# EAGLE design driver (EAGLE 6.4)
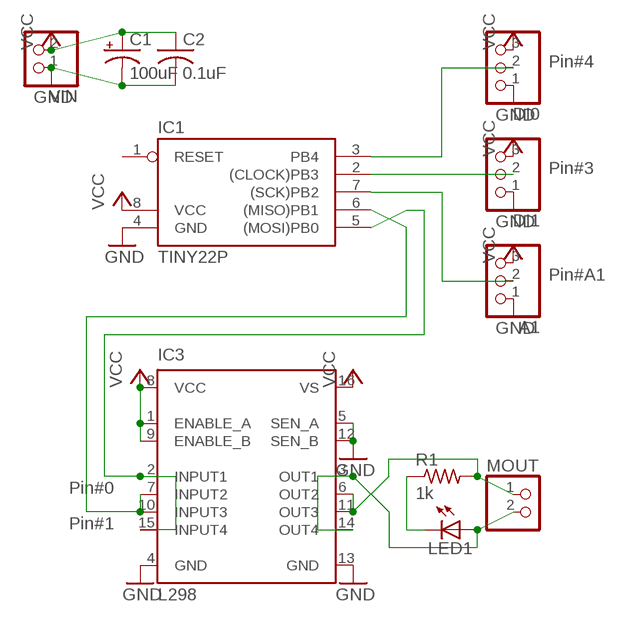
[diagram p0: schematic, sheet 1]

## Parts
A1  PINHD-1X3  [1X03]
C1  100uF  CPOL-USE2,5-6E  [E2,5-6E]
C2  0.1uF  C-US025-025X050  [C025-025X050]
DI0  PINHD-1X3  [1X03]
DI1  PINHD-1X3  [1X03]
IC1  TINY22P  [DIL08]
IC3  L298  [DIL16]
LED1  LED5MM  [LED5MM]
MOUT  PINHD-1X2  [1X02]
R1  1k  R-US_0204/2V  [0204V]
VIN  PINHD-1X2  [1X02]

## Nets
GND: A1.1 C1.- C2.2 DI0.1 DI1.1 IC1.4(GND) IC3.4(GND) IC3.5(SEN_A) IC3.12(SEN_B) IC3.13(GND) VIN.1
N$1: IC1.5((MOSI)PB0) IC3.2(INPUT1) IC3.15(INPUT4)
N$2: IC1.6((MISO)PB1) IC3.7(INPUT2) IC3.10(INPUT3)
N$3: IC3.6(OUT2) IC3.11(OUT3) MOUT.1 R1.2
N$4: IC3.3(OUT1) IC3.14(OUT4) LED1.A MOUT.2
N$7: LED1.K(C) R1.1
N$8: DI1.2 IC1.2((CLOCK)PB3)
N$9: DI0.2 IC1.3(PB4)
N$10: A1.2 IC1.7((SCK)PB2)
VCC: A1.3 C1.+ C2.1 DI0.3 DI1.3 IC1.8(VCC) IC3.1(ENABLE_A) IC3.8(VCC) IC3.9(ENABLE_B) IC3.16(VS) VIN.2
Unconnected: IC1.1(RESET)

## Notes on the sheet
- Pin#4
- Pin#3
- Pin#A1
- Pin#0
- Pin#1

## Library data of the parts
A1 DI0 DI1 = pinhead:PINHD-1X3: PIN HEADER
C1 = resistor:CPOL-US: POLARIZED CAPACITOR, American symbol
C2 = resistor:C-US: CAPACITOR, American symbol
IC1 = atmel:TINY22: MICROCONTROLLER 1K ROM 128 bytes RAM 128 bytes EEPROM; OC_FARNELL: unknown; OC_NEWARK: unknown
IC3 = st-microelectronics:L298: DUAL FULL-BRIDGE DRIVER
LED1 = led:LED: LED OSRAM: - CHIPLED LG R971, LG N971, LY N971, LG Q971, LY Q971, LO R971, LY R971 LH N974, LH R974 LS Q976, LO Q976, LY Q976 LO Q996 - Hyper CHIPLED LW Q18S LB Q993, LB Q99A, LB R99A - SideLED LS A670, LO A670, LY A670, LG A670, LP A670 LB A673, LV A673, LT A673, LW A673 LH A674 LY A675 LS A676, LA A676, LO A676, LY A676, LW A676 LS A679, LY A679, LG A679 - Hyper Micro SIDELED® LS Y876, LA Y876, LO Y876, LY Y876 LT Y87S - SmartLED LW L88C, LW L88S LB L89C, LB L89S, LG L890 LS L89K, LO L89K, LY L89K LS L896, LA L896, LO L896, LY L896 - TOPLED LS T670, LO T670, LY T670, LG T670, LP T670 LSG T670, LSP T670, LSY T670, LOP T670, LYG T670 LG T671, LOG T671, LSG T671 LB T673, LV T673, LT T673, LW T673 LH T674 LS T676, LA T676, LO T676, LY T676, LB T676, LH T676, LSB T676, LW T676 LB T67C, LV T67C, LT T67C, LS T67K, LO T67K, LY T67K, LW E67C LS E67B, LA E67B, LO E67B, LY E67B, LB E67C, LV E67C, LT E67C LW T67C LS T679, LY T679, LG T679 LS T770, LO T770, LY T770, LG T770, LP T770 LB T773, LV T773, LT T773, LW T773 LH T774 LS E675, LA E675, LY E675, LS T675 LS T776, LA T776, LO T776, LY T776, LB T776 LHGB T686 LT T68C, LB T68C - Hyper Mini TOPLED® LB M676 - Mini TOPLED Santana® LG M470 LS M47K, LO M47K, LY M47K Source: http://www.osram.convergy.de LUXEON: - LUMILED® LXK2-PW12-R00, LXK2-PW12-S00, LXK2-PW14-U00, LXK2-PW14-V00 LXK2-PM12-R00, LXK2-PM12-S00, LXK2-PM14-U00 LXK2-PE12-Q00, LXK2-PE12-R00, LXK2-PE12-S00, LXK2-PE14-T00, LXK2-PE14-U00 LXK2-PB12-K00, LXK2-PB12-L00, LXK2-PB12-M00, LXK2-PB14-N00, LXK2-PB14-P00, LXK2-PB14-Q00 LXK2-PR12-L00, LXK2-PR12-M00, LXK2-PR14-Q00, LXK2-PR14-R00 LXK2-PD12-Q00, LXK2-PD12-R00, LXK2-PD12-S00 LXK2-PH12-R00, LXK2-PH12-S00 LXK2-PL12-P00, LXK2-PL12-Q00, LXK2-PL12-R00 Source: www.luxeon.com KINGBRIGHT: KA-3528ASYC Source: www.kingbright.com
MOUT VIN = pinhead:PINHD-1X2: PIN HEADER
R1 = resistor:R-US_: RESISTOR, American symbol

## Board
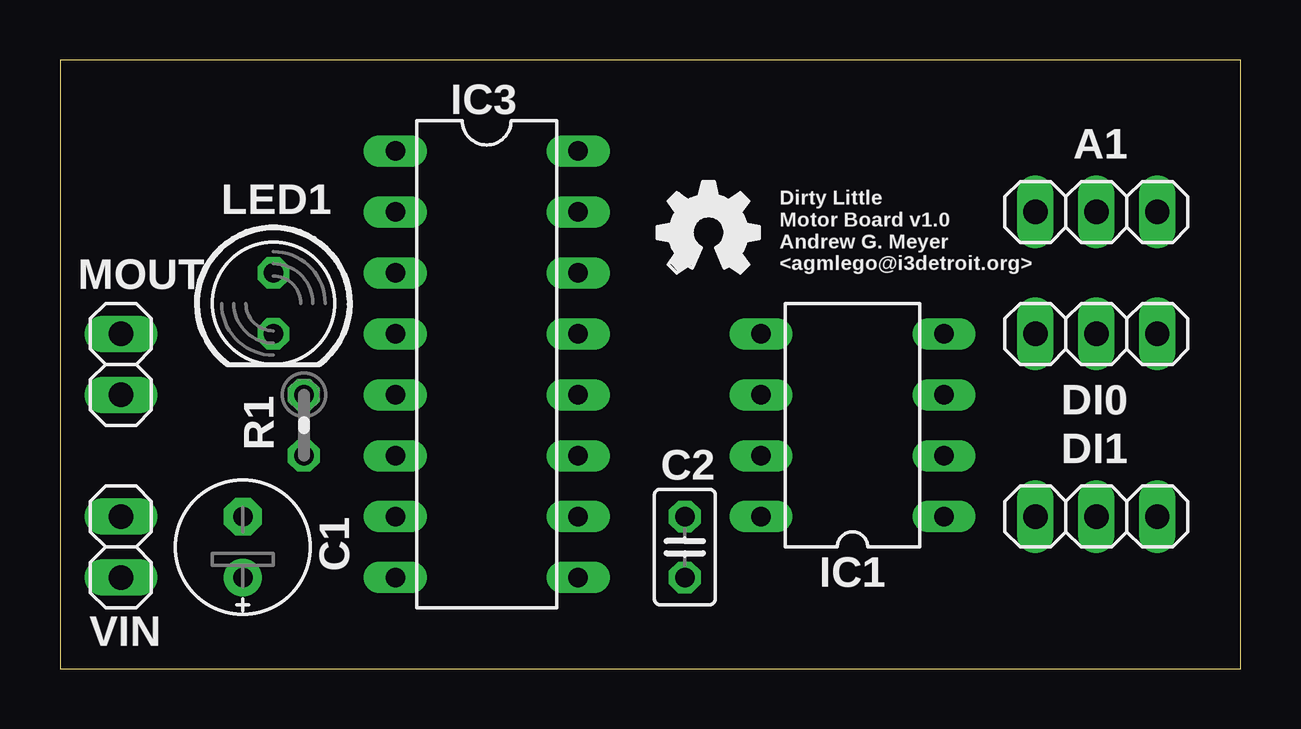
[diagram p1: board, top side]
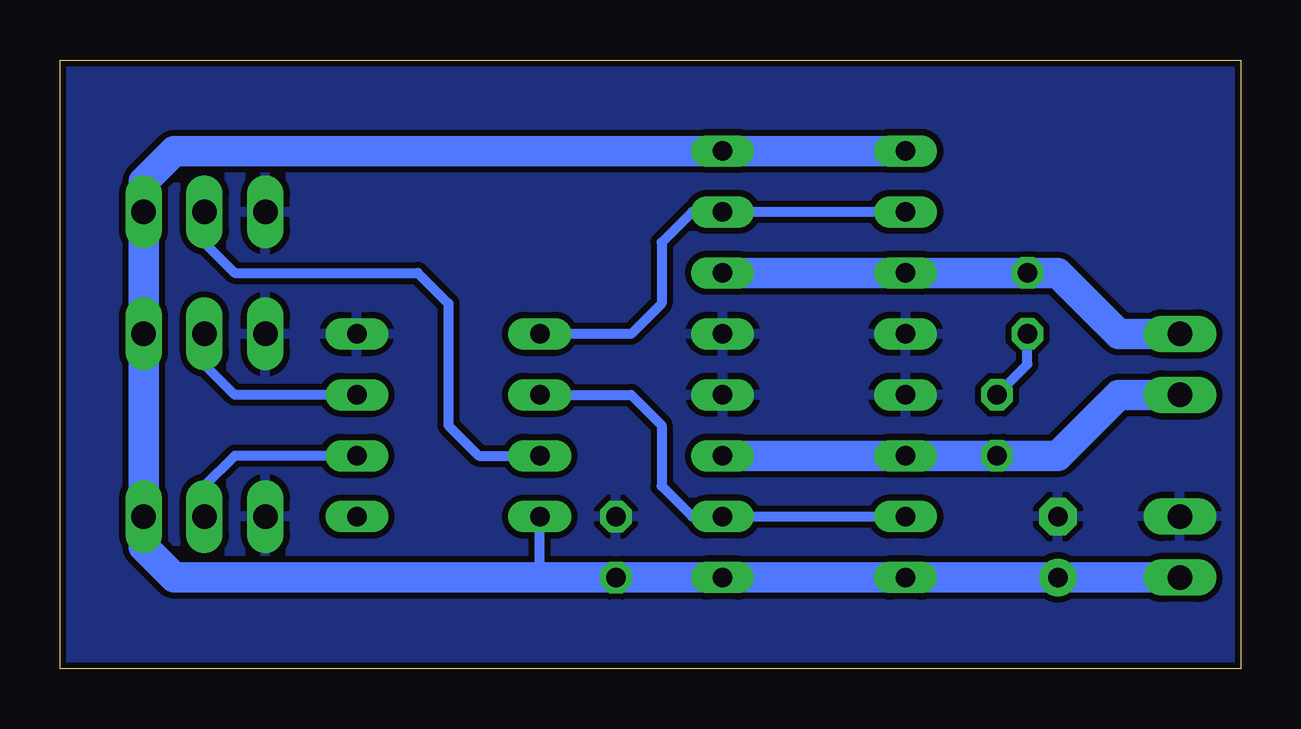
[diagram p2: board, bottom side, seen from below]

Size 49.2 x 25.39 mm. Coordinates in mm from the lower left corner, seen from the top.
Outline: 0,0 49.2,0 49.2,25.39 0,25.39 0,0
Copper layers (1*16): Top 0.035mm / dielectric 1.5mm / Bottom 0.035mm
Design rules "dirt_cheap_dirty_boards.v1": minimum track width 5mil, minimum drill 12mil, track to track 5mil, track to pad 5mil, pad to pad 5mil, via to via 5mil, smd to smd 0mil, copper to edge 10mil, drill to drill 10mil, minimum pad ring 10mil, minimum via ring 6mil, stop-mask expansion 2mil, vias tented up to drill 25mil, thermal gap 10mil

### Footprints (pad centres in the part's own frame; a part is rotated, then mirrored left to right if it is on the bottom)
1X03 = drill 1.016 long: 1 -2.54,0; 2 0,0; 3 2.54,0
E2,5-6E = drill 0.813 pad 1.575: + -1.27,0 | drill 0.813 pad 1.575 octagon: - 1.27,0
C025-025X050 = drill 0.813 octagon: 1 -1.27,0; 2 1.27,0
DIL08 = drill 0.813 long: 1 -3.81,-3.81; 2 -1.27,-3.81; 3 1.27,-3.81; 4 3.81,-3.81; 5 3.81,3.81; 6 1.27,3.81; 7 -1.27,3.81; 8 -3.81,3.81
DIL16 = drill 0.813 long: 1 -8.89,-3.81; 2 -6.35,-3.81; 3 -3.81,-3.81; 4 -1.27,-3.81; 5 1.27,-3.81; 6 3.81,-3.81; 7 6.35,-3.81; 8 8.89,-3.81; 9 8.89,3.81; 10 6.35,3.81; 11 3.81,3.81; 12 1.27,3.81; 13 -1.27,3.81; 14 -3.81,3.81; 15 -6.35,3.81; 16 -8.89,3.81
LED5MM = drill 0.813 octagon: A -1.27,0; K 1.27,0
1X02 = drill 1.016 long: 1 -1.27,0; 2 1.27,0
0204V = drill 0.813 octagon: 1 -1.27,0; 2 1.27,0

### Placement (x,y rotation side)
A1  43.18,19.05 0 top
C1  7.62,5.08 90 top
C2  26.04,5.08 90 top
DI0  43.18,13.97 0 top
DI1  43.18,6.35 0 top
IC1  33.02,10.16 90 top
IC3  17.78,12.7 270 top
LED1  8.89,15.24 270 top
MOUT  2.54,12.7 90 top
R1  10.16,10.16 270 top
U$1  [OSHW_FILLX150_NOTEXT]  24.89,16.51 0 top
VIN  2.54,5.08 270 top

### Tracks (layer width: path | path; a pad name or v marks a point on that pad's centre or on a via)
GND
  pour Bottom (isolate 0.254): 0,0 49.53,0 49.53,25.4 0,25.4
N$1
  Bottom 0.406: IC3.2 IC3.15 22.86,19.05 24.13,17.78 24.13,15.24 25.4,13.97 IC1.5
N$2
  Bottom 0.406: IC1.6 25.4,11.43 24.13,10.16 24.13,7.62 22.86,6.35 IC3.10 IC3.7
N$3
  Bottom 1.27: IC3.11 IC3.6 R1.2 7.62,8.89 5.08,11.43 MOUT.1
N$4
  Bottom 1.27: IC3.14 IC3.3 LED1.A 7.62,16.51 5.08,13.97 MOUT.2
N$7
  Bottom 0.406: R1.1 8.89,12.7 LED1.K
N$8
  Bottom 0.406: IC1.2 41.91,8.89 43.18,7.62 DI1.2
N$9
  Bottom 0.406: IC1.3 41.91,11.43 43.18,12.7 DI0.2
N$10
  Bottom 0.406: A1.2 43.18,17.78 41.91,16.51 34.29,16.51 33.02,15.24 33.02,10.16 31.75,8.89 IC1.7
VCC
  Bottom 0.406: 29.21,3.81 IC1.8
  Bottom 1.27: IC3.1 IC3.16 44.45,21.59 45.72,20.32 A1.3 DI0.3 DI1.3 45.72,5.08 44.45,3.81 29.21,3.81 C2.1 IC3.9 IC3.8 C1.+ VIN.2

### Text on the board
tNames: Dirty Little / Motor Board v1.0 / Andrew G. Meyer / <agmlego@i3detroit.org>